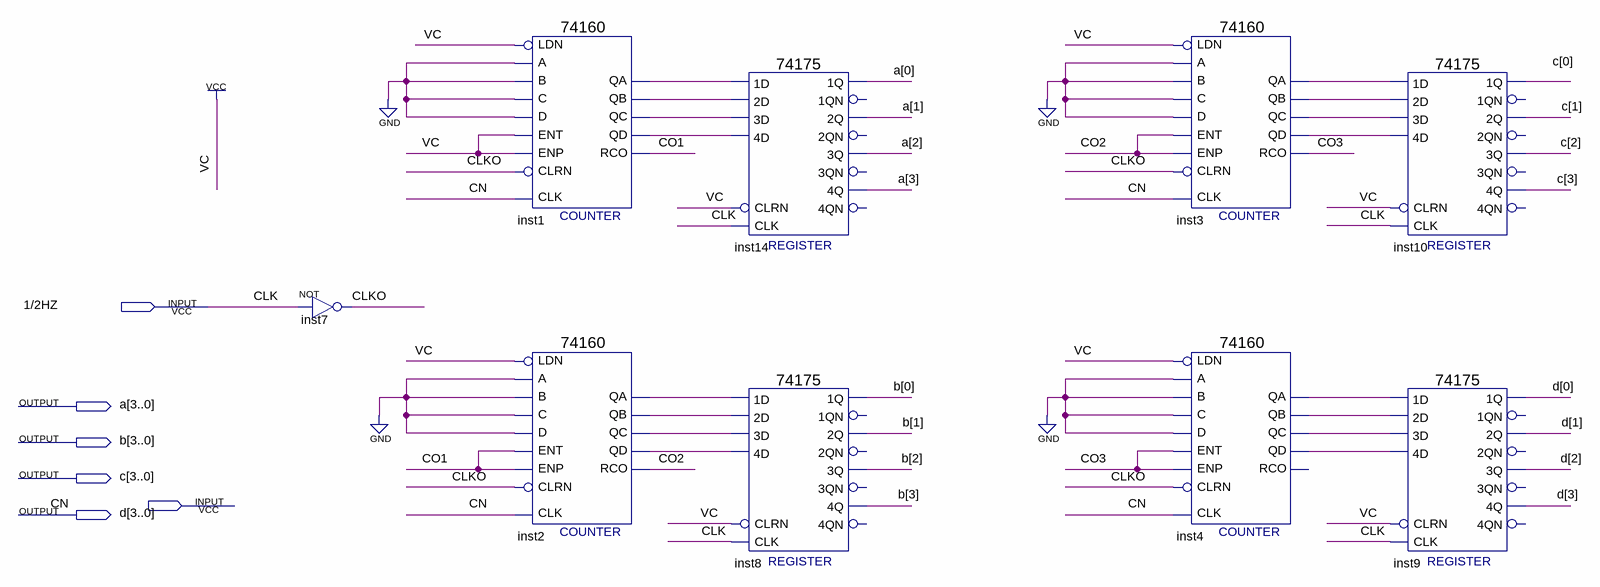
[diagram p0: schematic sheet]
// Quartus schematic CEPIN.bdf as structural Verilog: 9 symbols, 6 pins
module CEPIN (
  input  \1/2HZ ,
  input  CN,
  output [3:0] a,
  output [3:0] b,
  output [3:0] c,
  output [3:0] d
);

  wire CLKO, CO1, CO2, CO3, inst1_qa, inst1_qb, inst1_qc, inst1_qd, inst2_qa, inst2_qb, inst2_qc, inst2_qd,
       inst3_qa, inst3_qb, inst3_qc, inst3_qd, inst4_qa, inst4_qb, inst4_qc, inst4_qd;

  not inst7 (CLKO, \1/2HZ );
  \74160  inst1 (
    .CLK(CN), .ENT(1'b1), .A(1'b0), .B(1'b0), .C(1'b0), .D(1'b0), .LDN(1'b1), .ENP(1'b1), .CLRN(CLKO),
    .QD(inst1_qd), .QA(inst1_qa), .QB(inst1_qb), .QC(inst1_qc), .RCO(CO1));
  \74160  inst2 (
    .CLK(CN), .ENT(CO1), .A(1'b0), .B(1'b0), .C(1'b0), .D(1'b0), .LDN(1'b1), .ENP(CO1), .CLRN(CLKO),
    .QD(inst2_qd), .QA(inst2_qa), .QB(inst2_qb), .QC(inst2_qc), .RCO(CO2));
  \74175  inst14 (
    .CLRN(1'b1), .CLK(\1/2HZ ), .\3D (inst1_qc), .\2D (inst1_qb), .\1D (inst1_qa), .\4D (inst1_qd),
    .\1Q (a[0]), .\3Q (a[2]), .\2Q (a[1]), .\4Q (a[3]));  // open: 1QN, 2QN, 4QN, 3QN
  \74175  inst8 (
    .CLRN(1'b1), .CLK(\1/2HZ ), .\3D (inst2_qc), .\2D (inst2_qb), .\1D (inst2_qa), .\4D (inst2_qd),
    .\1Q (b[0]), .\3Q (b[2]), .\2Q (b[1]), .\4Q (b[3]));  // open: 1QN, 2QN, 4QN, 3QN
  \74160  inst3 (
    .CLK(CN), .ENT(CO2), .A(1'b0), .B(1'b0), .C(1'b0), .D(1'b0), .LDN(1'b1), .ENP(CO2), .CLRN(CLKO),
    .QD(inst3_qd), .QA(inst3_qa), .QB(inst3_qb), .QC(inst3_qc), .RCO(CO3));
  \74160  inst4 (
    .CLK(CN), .ENT(CO3), .A(1'b0), .B(1'b0), .C(1'b0), .D(1'b0), .LDN(1'b1), .ENP(CO3), .CLRN(CLKO),
    .QD(inst4_qd), .QA(inst4_qa), .QB(inst4_qb), .QC(inst4_qc));  // open: RCO
  \74175  inst10 (
    .CLRN(1'b1), .CLK(\1/2HZ ), .\3D (inst3_qc), .\2D (inst3_qb), .\1D (inst3_qa), .\4D (inst3_qd),
    .\1Q (c[0]), .\3Q (c[2]), .\2Q (c[1]), .\4Q (c[3]));  // open: 1QN, 2QN, 4QN, 3QN
  \74175  inst9 (
    .CLRN(1'b1), .CLK(\1/2HZ ), .\3D (inst4_qc), .\2D (inst4_qb), .\1D (inst4_qa), .\4D (inst4_qd),
    .\1Q (d[0]), .\3Q (d[2]), .\2Q (d[1]), .\4Q (d[3]));  // open: 1QN, 2QN, 4QN, 3QN

  // Other names for the same wires on the sheet: CLK = \1/2HZ 
endmodule
